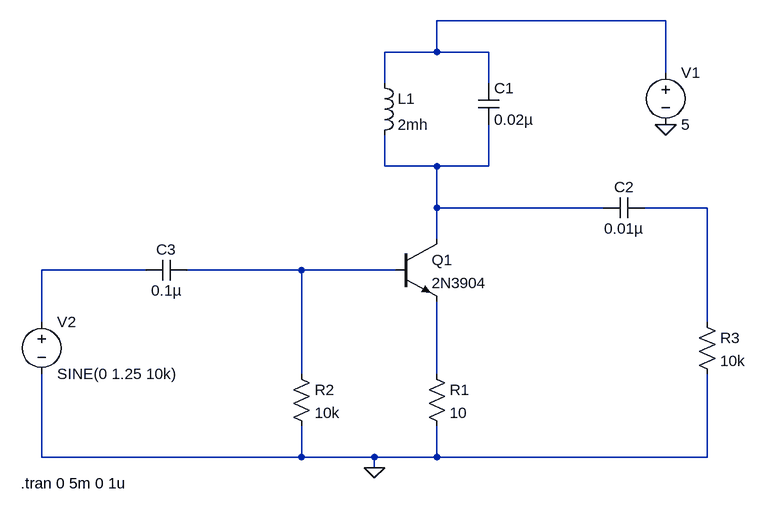
[diagram p0: schematic analysis of power amp.asc]
analysis of power amp.asc, the LTspice schematic file:
Version 4.1
SHEET 1 880 712
WIRE 384 -16 32 -16
WIRE 32 32 32 -16
WIRE 32 32 -48 32
WIRE 112 32 32 32
WIRE 384 64 384 -16
WIRE -48 80 -48 32
WIRE 112 80 112 32
WIRE -48 208 -48 160
WIRE 32 208 -48 208
WIRE 112 208 112 144
WIRE 112 208 32 208
WIRE 32 272 32 208
WIRE 288 272 32 272
WIRE 448 272 352 272
WIRE 32 320 32 272
WIRE -416 368 -576 368
WIRE -176 368 -352 368
WIRE -32 368 -176 368
WIRE -576 448 -576 368
WIRE 448 448 448 272
WIRE -176 528 -176 368
WIRE 32 528 32 416
WIRE -576 656 -576 528
WIRE -176 656 -176 608
WIRE -176 656 -576 656
WIRE -64 656 -176 656
WIRE 32 656 32 608
WIRE 32 656 -64 656
WIRE 448 656 448 528
WIRE 448 656 32 656
WIRE -64 672 -64 656
FLAG 384 144 0
FLAG -64 672 0
SYMBOL voltage 384 48 R0
SYMATTR InstName V1
SYMATTR Value 5
SYMBOL ind -64 64 R0
SYMATTR InstName L1
SYMATTR Value 2mh
SYMBOL cap 96 80 R0
SYMATTR InstName C1
SYMATTR Value 0.02µ
SYMBOL npn -32 320 R0
SYMATTR InstName Q1
SYMATTR Value 2N3904
SYMBOL cap 352 256 R90
WINDOW 0 0 32 VBottom 2
WINDOW 3 32 32 VTop 2
SYMATTR InstName C2
SYMATTR Value 0.01µ
SYMBOL res 16 512 R0
SYMATTR InstName R1
SYMATTR Value 10
SYMBOL res -192 512 R0
SYMATTR InstName R2
SYMATTR Value 10k
SYMBOL res 432 432 R0
SYMATTR InstName R3
SYMATTR Value 10k
SYMBOL cap -352 352 R90
WINDOW 0 0 32 VBottom 2
WINDOW 3 32 32 VTop 2
SYMATTR InstName C3
SYMATTR Value 0.1µ
SYMBOL voltage -576 432 R0
WINDOW 123 0 0 Left 0
WINDOW 39 0 0 Left 0
SYMATTR InstName V2
SYMATTR Value SINE(0 1.25 10k)
TEXT -608 696 Left 2 !.tran 0 5m 0 1u

The netlist it stands for:
* analysis of power amp.asc
V1 N001 0 5
L1 N001 N002 2mh
C1 N001 N002 0.02µ
Q1 N002 N005 N006 0 2N3904
C2 N003 N002 0.01µ
R1 N006 0 10
R2 N005 0 10k
R3 N003 0 10k
C3 N005 N004 0.1µ
V2 N004 0 SINE(0 1.25 10k)
.model NPN NPN
.model PNP PNP
.lib standard.bjt
.tran 0 5m 0 1u
.backanno
.end